# Altium schematic sheet stm32.SchDoc
size A4; SheetNumber: 2; SheetTotal: 3
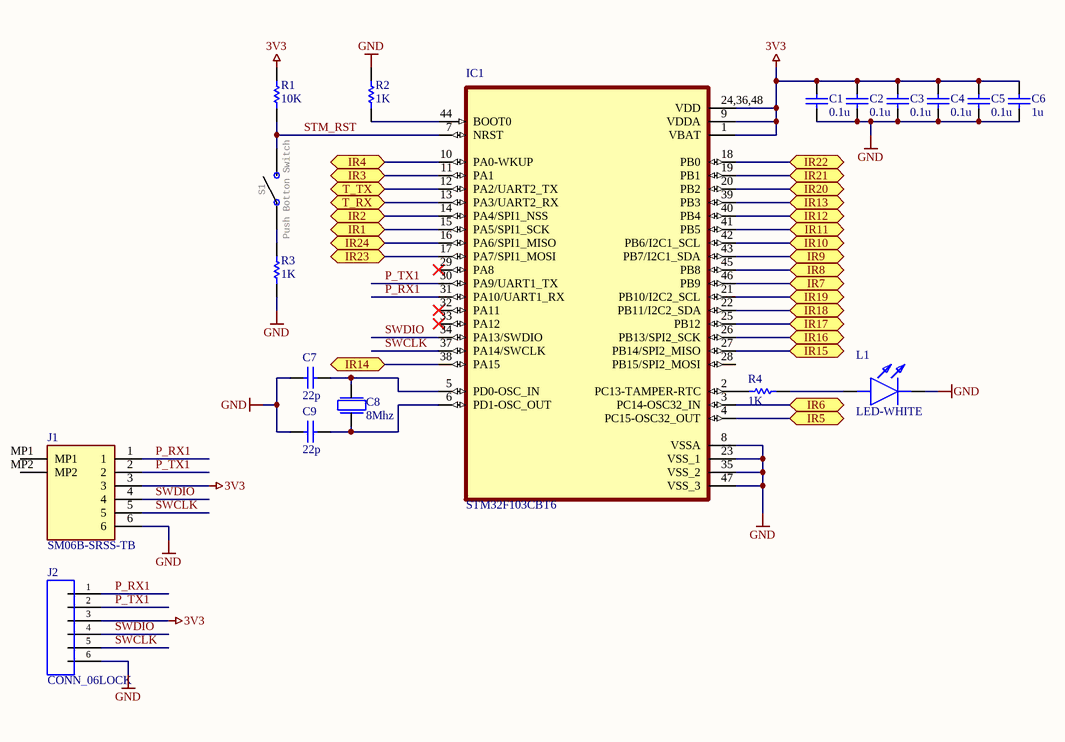
[diagram p0: stm32.SchDoc]

## Parts
C1  0.1u  [CAP0603]
C2  0.1u  [CAP0603]
C3  0.1u  [CAP0603]
C4  0.1u  [CAP0603]
C5  0.1u  [CAP0603]
C6  1u  [CAP0603]
C7  22p  [CAP0603]
C8  8Mhz  [CRYSTAL-8MHZ]
C9  22p  [CAP0603]
IC1  STM32F103CBT6  [QFP50P900X900X160-48N]
J1  SM06B-SRSS-TB  [SM06BSRSSTB]
J2  CONN_06LOCK  [1X06_LOCK]
L1  LED-WHITE  [LED0603]
R1  10K  [RES0603]
R2  1K  [RES0603]
R3  1K  [RES0603]
R4  1K  [RES0603]
S1  Push Botton Switch  [MOMENTARY_SWITCH_4X3]

## Ports
IR1 (bidir), IR2 (bidir), IR3 (bidir), IR4 (bidir), IR5 (bidir), IR6 (bidir), IR7 (bidir), IR8 (bidir), IR9 (bidir), IR10 (bidir), IR11 (bidir), IR12 (bidir), IR13 (bidir), IR14 (bidir), IR15 (bidir), IR16 (bidir), IR17 (bidir), IR18 (bidir), IR19 (bidir), IR20 (bidir), IR21 (bidir), IR22 (bidir), IR23 (bidir), IR24 (bidir), T_RX (bidir), T_TX (bidir)

## Nets
3V3: C1.2 C2.2 C3.2 C4.2 C5.2 C6.2 IC1.1(VBAT) IC1.9(VDDA) IC1.24,36,48(VDD) J1.3 J2.3 R1.2
GND: C1.1 C2.1 C3.1 C4.1 C5.1 C6.1 C7.2 C9.2 IC1.8(VSSA) IC1.23(VSS_1) IC1.35(VSS_2) IC1.47(VSS_3) J1.6 J2.6 L1.1(K) R2.2 R3.1
IR1: IC1.15(PA5/SPI1_SCK) ; port IR1
IR2: IC1.14(PA4/SPI1_NSS) ; port IR2
IR3: IC1.11(PA1) ; port IR3
IR4: IC1.10(PA0-WKUP) ; port IR4
IR5: IC1.4(PC15-OSC32_OUT) ; port IR5
IR6: IC1.3(PC14-OSC32_IN) ; port IR6
IR7: IC1.46(PB9) ; port IR7
IR8: IC1.45(PB8) ; port IR8
IR9: IC1.43(PB7/I2C1_SDA) ; port IR9
IR10: IC1.42(PB6/I2C1_SCL) ; port IR10
IR11: IC1.41(PB5) ; port IR11
IR12: IC1.40(PB4) ; port IR12
IR13: IC1.39(PB3) ; port IR13
IR14: IC1.38(PA15) ; port IR14
IR15: IC1.27(PB14/SPI2_MISO) ; port IR15
IR16: IC1.26(PB13/SPI2_SCK) ; port IR16
IR17: IC1.25(PB12) ; port IR17
IR18: IC1.22(PB11/I2C2_SDA) ; port IR18
IR19: IC1.21(PB10/I2C2_SCL) ; port IR19
IR20: IC1.20(PB2) ; port IR20
IR21: IC1.19(PB1) ; port IR21
IR22: IC1.18(PB0) ; port IR22
IR23: IC1.17(PA7/SPI1_MOSI) ; port IR23
IR24: IC1.16(PA6/SPI1_MISO) ; port IR24
P_RX1: IC1.31(PA10/UART1_RX) J1.1 J2.1
P_TX1: IC1.30(PA9/UART1_TX) J1.2 J2.2
STM_RST: IC1.7(NRST) R1.1 S1.2
SWCLK: IC1.37(PA14/SWCLK) J1.5 J2.5
SWDIO: IC1.34(PA13/SWDIO) J1.4 J2.4
T_RX: IC1.13(PA3/UART2_RX) ; port T_RX
T_TX: IC1.12(PA2/UART2_TX) ; port T_TX
NetC7_1: C7.1 C8.2 IC1.5(PD0-OSC_IN)
NetC8_1: C8.1 C9.1 IC1.6(PD1-OSC_OUT)
NetIC1_2: IC1.2(PC13-TAMPER-RTC) R4.2
NetIC1_44: IC1.44(BOOT0) R2.1
NetL1_2: L1.2(A) R4.1
NetR3_2: R3.2 S1.1

Not connected (* = marked no-connect by the designer): IC1 28(PB15/SPI2_MOSI) 29(PA8)* 32(PA11)* 33(PA12)*; J1 MP1 MP2

## Library data of the parts
C1-C7 C9 = CAP0603: 0603 Capacitor
C8 = Crystal: 8/16Mhz
IC1 = STM32F103CBT6: ARMÂ® CortexÂ®-M3 STM32F1 Microcontroller IC 32-Bit 72MHz 128KB _128K x 8_ FLASH; Manufacturer_Name: STMicroelectronics; Datasheet Link: http://www.st.com/st-web-ui/static/active/en/resource/technical/document/datasheet/CD00161566.pdf; Height: 1.6mm; Manufacturer_Part_Number: STM32F103CBT6; Mouser Part Number: 511-STM32F103CBT6; Mouser Price/Stock: https://www.mouser.co.uk/ProductDetail/STMicroelectronics/STM32F103CBT6?qs=WxFF5lh7QM3goh6GV5Ogig%3D%3D; Arrow Part Number: STM32F103CBT6; Arrow Price/Stock: https://www.arrow.com/en/products/stm32f103cbt6/stmicroelectronics?region=europe
J1 = SM06B-SRSS-TB: Connector; Manufacturer_Name: JST (JAPAN SOLDERLESS TERMINALS); Datasheet Link: https://media.digikey.com/pdf/Data%20Sheets/JST%20PDFs/SR%20Connector.pdf; Height: 2.95mm; Manufacturer_Part_Number: SM06B-SRSS-TB
L1 = LED-0603
R1-R4 = RES0603: Resistor